# Altium project Cuk_30Gan_Grid_Project.PrjPcb
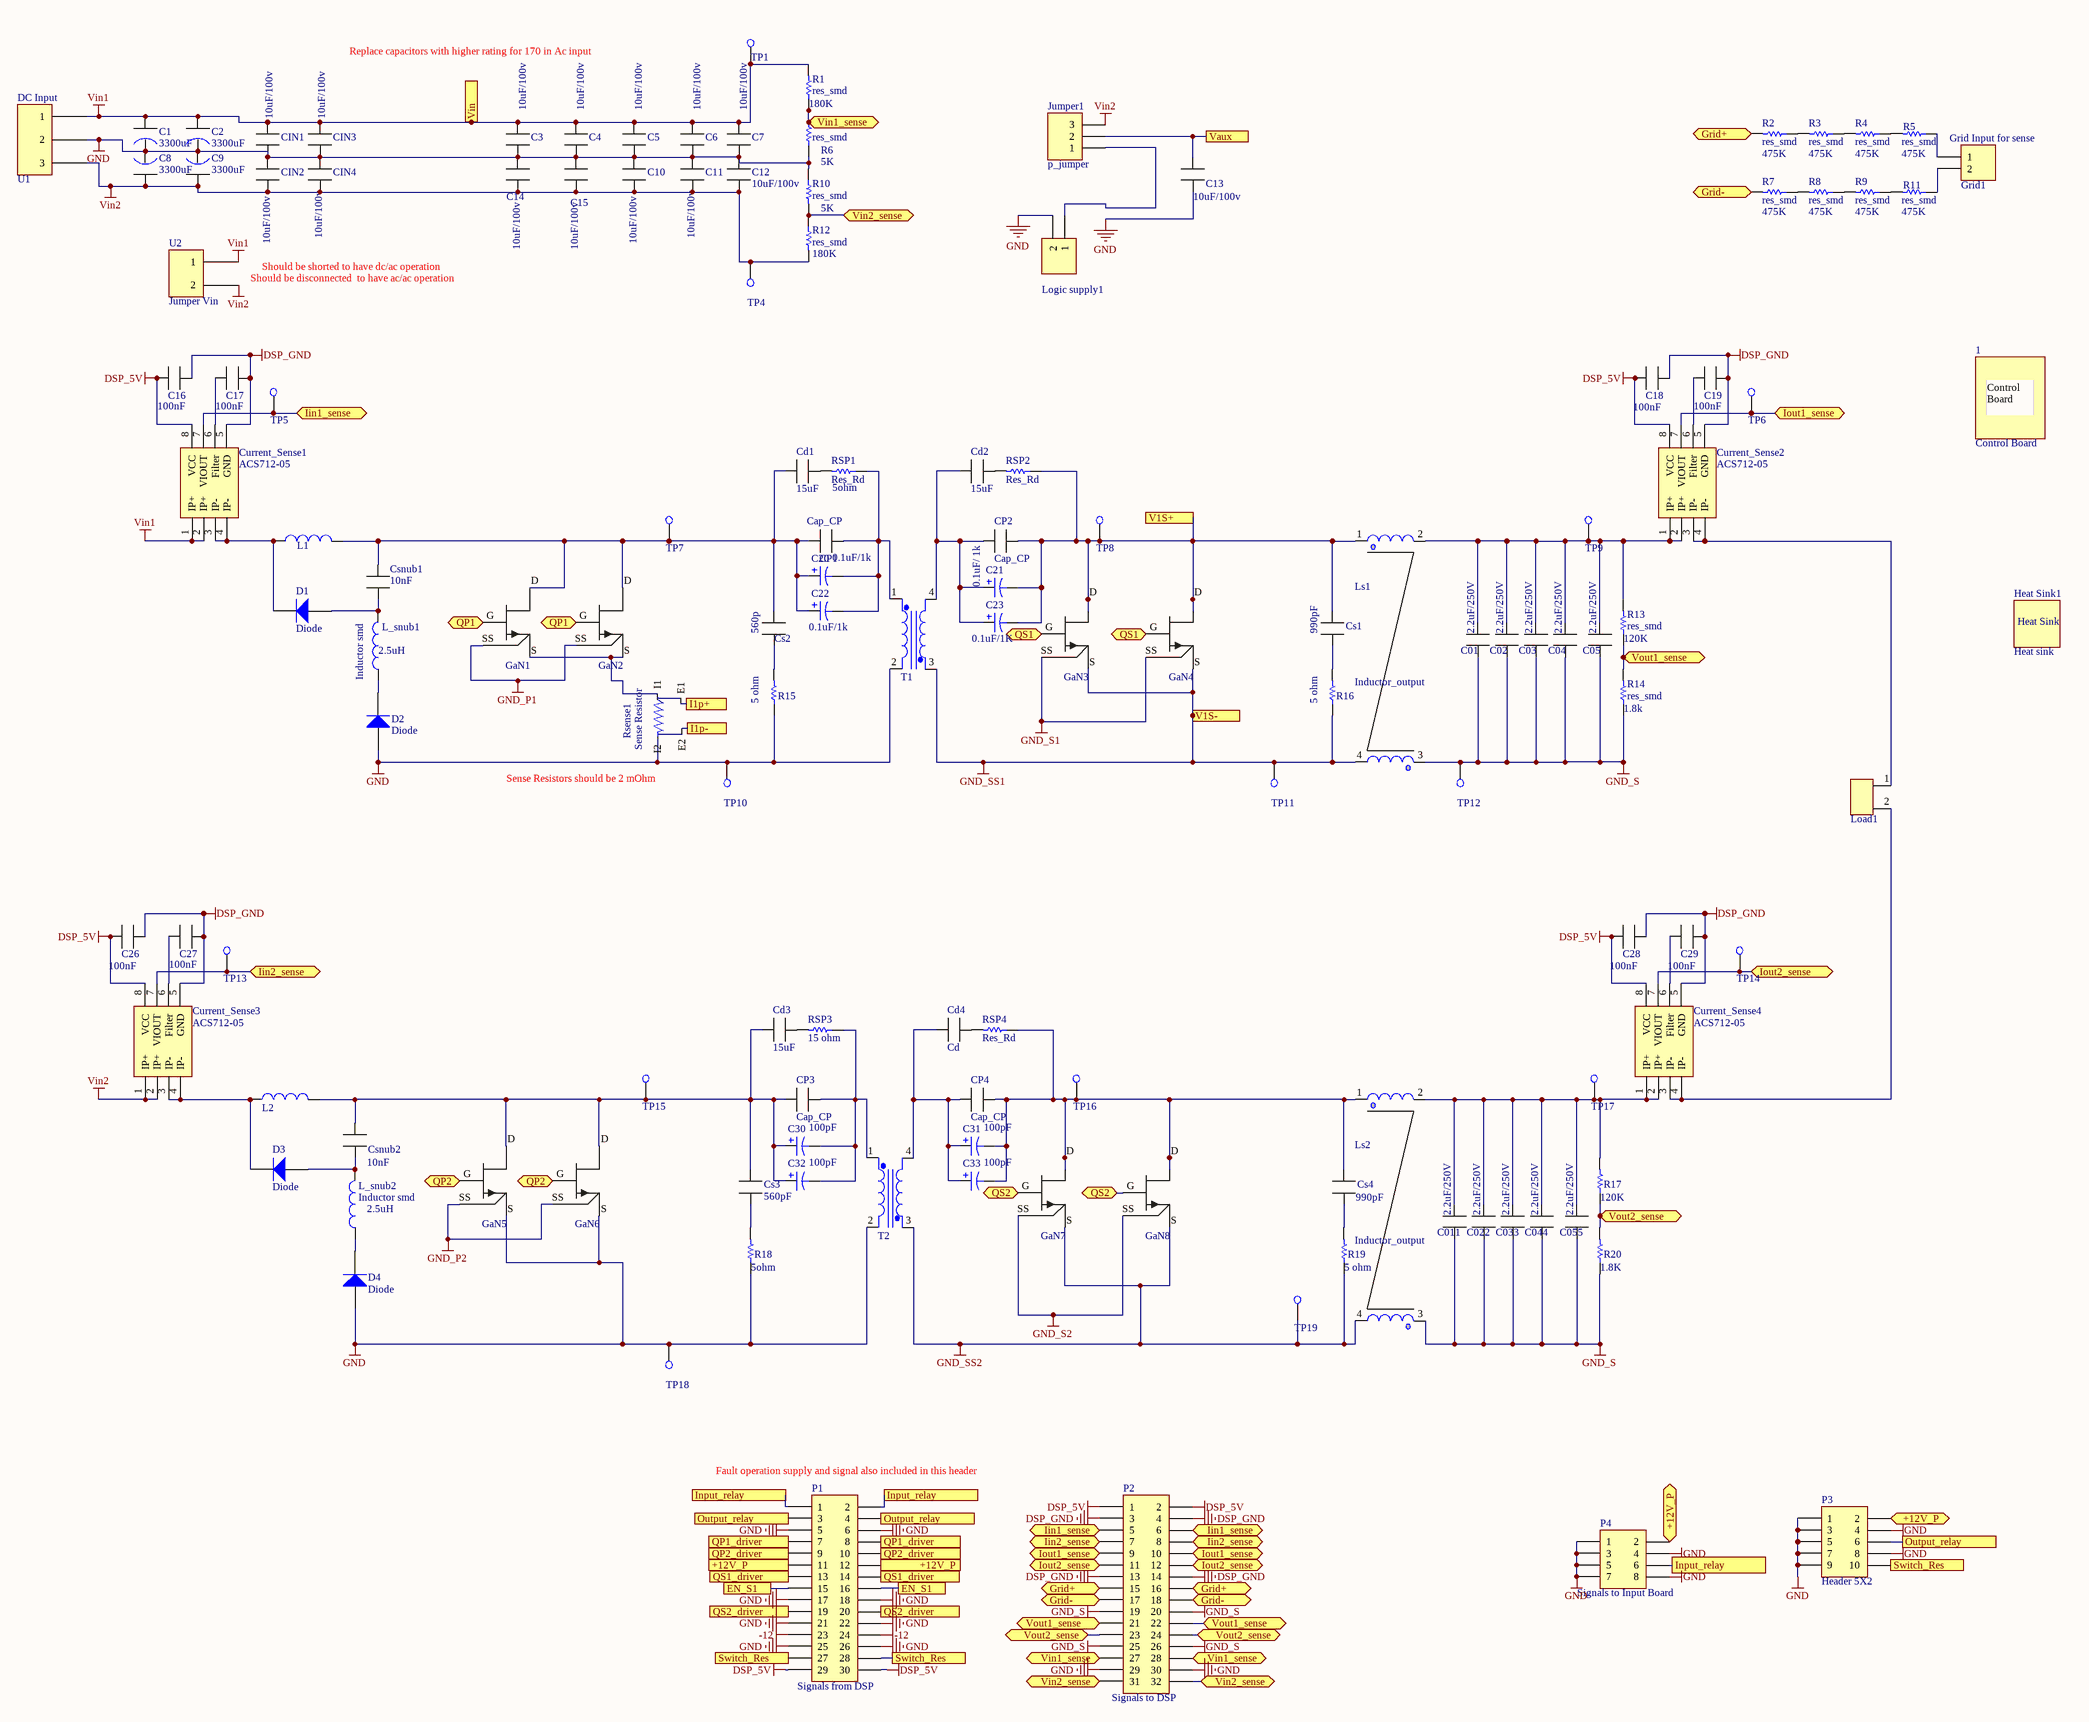
[diagram p0: Power_Board.SchDoc]
5 sheets, 394 parts. Net scope: flat (ports and power ports of the same name join across sheets).
Sheets:
  Power_Board.SchDoc
  Gate_Drivers.SchDoc
  Power_Supply.SchDoc
  Power_Supply2.SchDoc
  Protection_logic.SchDoc

## Sheet Power_Board.SchDoc: Power Stage Cuk 30 Amp GaN Board
size A2

### Parts
1  Control Board  [Control Board]
C1  3300uF  [Cap_3300uF_35mm height]
C01  Output_cap  [Output cap]  (value not drawn)
C02  Output_cap  [Output cap]  (value not drawn)
C2  3300uF  [Cap_3300uF_35mm height]
C3  Output_cap  [Output cap]  (value not drawn)
C03  Output_cap  [Output cap]  (value not drawn)
C4  Output_cap  [Output cap]  (value not drawn)
C04  Output_cap  [Output cap]  (value not drawn)
C5  Output_cap  [Output cap]  (value not drawn)
C05  Output_cap  [Output cap]  (value not drawn)
C6  Output_cap  [Output cap]  (value not drawn)
C7  Output_cap  [Output cap]  (value not drawn)
C8  3300uF  [Cap_3300uF_35mm height]
C9  3300uF  [Cap_3300uF_35mm height]
C10  Output_cap  [Output cap]  (value not drawn)
C11  Output_cap  [Output cap]  (value not drawn)
C011  Output_cap  [Output cap]  (value not drawn)
C12  Output_cap  [Output cap]  (value not drawn)
C13  Output_cap  [Output cap]  (value not drawn)
C14  Output_cap  [Output cap]  (value not drawn)
C15  Output_cap  [Output cap]  (value not drawn)
C16  100nF  [Cap_SMD]
C17  100nF  [Cap_SMD]
C18  100nF  [Cap_SMD]
C19  100nF  [Cap_SMD]
C20  value 0.1uF/1k  [1812]  (hidden comment: Cap Pol3)
C21  value 0.1uF/ 1k  [1812]  (hidden comment: Cap Pol3)
C22  value 0.1uF/1k  [1812]  (hidden comment: Cap Pol3)
C022  Output_cap  [Output cap]  (value not drawn)
C23  value 0.1uF/1K  [1812]  (hidden comment: Cap Pol3)
C26  100nF  [Cap_SMD]
C27  100nF  [Cap_SMD]
C28  100nF  [Cap_SMD]
C29  100nF  [Cap_SMD]
C30  value 100pF  [1812]  (hidden comment: Cap Pol3)
C31  value 100pF  [1812]  (hidden comment: Cap Pol3)
C32  value 100pF  [1812]  (hidden comment: Cap Pol3)
C33  value 100pF  [1812]  (hidden comment: Cap Pol3)
C033  Output_cap  [Output cap]  (value not drawn)
C044  Output_cap  [Output cap]  (value not drawn)
C055  Output_cap  [Output cap]  (value not drawn)
Cd1  15uF  [Cd]
Cd2  15uF  [Cd]
Cd3  15uF  [Cd]
Cd4  Cd  [Cd]
CIN1  Output_cap  [Output cap]  (value not drawn)
CIN2  Output_cap  [Output cap]  (value not drawn)
CIN3  Output_cap  [Output cap]  (value not drawn)
CIN4  Output_cap  [Output cap]  (value not drawn)
CP1  Cap_CP  [Cap_cp]
CP2  Cap_CP  [Cap_cp]
CP3  Cap_CP  [Cap_cp]
CP4  Cap_CP  [Cap_cp]
Cs1  990pF  [Cap-Cs]
Cs2  560p  [Cap-Cs]
Cs3  560pF  [Cap-Cs]
Cs4  Cap cdv16ff101j03  [Cap-Cs]  (value not drawn)
Csnub1  Cap DPPM10S22K-F  [Cap-Csnub]  (value not drawn)
Csnub2  Cap DPPM10S22K-F  [Cap-Csnub]  (value not drawn)
Current_Sense1  ACS712-05  [SOIC-8]
Current_Sense2  ACS712-05  [SOIC-8]
Current_Sense3  ACS712-05  [SOIC-8]
Current_Sense4  ACS712-05  [SOIC-8]
D1  Diode  [TO-277A]
D2  Diode  [TO-277A]
D3  Diode  [TO-277A]
D4  Diode  [TO-277A]
GaN1  GS66508B  [GS66508B]  (value not drawn)
GaN2  GS66508B  [GS66508B]  (value not drawn)
GaN3  GS66508B  [GS66508B]  (value not drawn)
GaN4  GS66508B  [GS66508B]  (value not drawn)
GaN5  GS66508B  [GS66508B]  (value not drawn)
GaN6  GS66508B  [GS66508B]  (value not drawn)
GaN7  GS66508B  [GS66508B]  (value not drawn)
GaN8  GS66508B  [GS66508B]  (value not drawn)
Grid1  Grid Input for sense  [Auxlilary connector]
Heat_Sink1  Heat sink  [Heat Sink]
Jumper1  p_jumper  [Header1*3]
L1  inductor  [Inductor_small]  (value not drawn)
L2  inductor  [Inductor_small_mirror]  (value not drawn)
L_snub1  Inductor smd  [Inductor surface mount]
L_snub2  Inductor smd  [Inductor surface mount]
Load1  Connector 60A  [Connector_60A]  (value not drawn)
Logic_supply1  Auxilary connector  [Auxlilary connector]  (value not drawn)
Ls1  Inductor_output  [Inductor output]
Ls2  Inductor_output  [Inductor output]
P1  Signals from DSP  [HDR2X15]
P2  Signals to DSP  [HDR2X16]
P3  Header 5X2  [HDR2X5]
P4  Signals to Input Board  [HDR2X4]
R1  res_smd  [res_smd]
R2  res_smd  [res_smd]
R3  res_smd  [res_smd]
R4  res_smd  [res_smd]
R5  res_smd  [res_smd]
R6  res_smd  [res_smd]
R7  res_smd  [res_smd]
R8  res_smd  [res_smd]
R9  res_smd  [res_smd]
R10  res_smd  [res_smd]
R11  res_smd  [res_smd]
R12  res_smd  [res_smd]
R13  res_smd  [res_smd]
R14  res_smd  [res_smd]
R15  res_snubber  [Res_Snub]  (value not drawn)
R16  res_snubber  [Res_Snub]  (value not drawn)
R17  res_smd  [res_smd]  (value not drawn)
R18  res_snubber  [Res_Snub]  (value not drawn)
R19  res_snubber  [Res_Snub]  (value not drawn)
R20  res_smd  [res_smd]  (value not drawn)
Rsense1  Sense Resistor  [Sense resistor]
RSP1  Res_Rd  [Res-RS]
RSP2  Res_Rd  [Res-RS]
RSP3  15 ohm  [Res-RS]
RSP4  Res_Rd  [Res-RS]
T1  Transformer  [Transformer]  (value not drawn)
T2  Transformer  [Big_transformer mirror]  (value not drawn)
TP1  Test Point  [Test Point]  (value not drawn)
TP4  Test Point  [Test Point]  (value not drawn)
TP5  Test Point  [Test Point]  (value not drawn)
TP6  Test Point  [Test Point]  (value not drawn)
TP7  Test Point  [Test Point]  (value not drawn)
TP8  Test Point  [Test Point]  (value not drawn)
TP9  Test Point  [Test Point]  (value not drawn)
TP10  Test Point  [Test Point]  (value not drawn)
TP11  Test Point  [Test Point]  (value not drawn)
TP12  Test Point  [Test Point]  (value not drawn)
TP13  Test Point  [Test Point]  (value not drawn)
TP14  Test Point  [Test Point]  (value not drawn)
TP15  Test Point  [Test Point]  (value not drawn)
TP16  Test Point  [Test Point]  (value not drawn)
TP17  Test Point  [Test Point]  (value not drawn)
TP18  Test Point  [Test Point]  (value not drawn)
TP19  Test Point  [Test Point]  (value not drawn)
U1  DC Input  [P-terminal 3]
U2  Jumper Vin  [P-Terminal 2]

### Ports
+12V_P, +12V_P (bidir), EN_S1, Grid+ (bidir), Grid- (bidir), I1p+, I1p-, Iin1_sense (bidir), Iin2_sense (bidir), Input_relay, Iout1_sense (bidir), Iout2_sense (bidir), Output_relay, QP1 (bidir), QP1_driver, QP2 (bidir), QP2_driver, QS1 (bidir), QS1_driver, QS2 (bidir), QS2_driver, Switch_Res, V1S+, V1S-, Vaux, Vin, Vin1_sense (bidir), Vin2_sense (bidir), Vout1_sense (bidir), Vout2_sense (bidir)

### Nets
-12: P1.23 P1.24
DSP_5V: C16.1 C18.1 C26.1 C28.1 Current_Sense1.8(VCC) Current_Sense2.8(VCC) Current_Sense3.8(VCC) Current_Sense4.8(VCC) P1.29 P1.30 P2.1 P2.2
DSP_GND: C16.2 C17.2 C18.2 C19.2 C26.2 C27.2 C28.2 C29.2 Current_Sense1.5(GND) Current_Sense2.5(GND) Current_Sense3.5(GND) Current_Sense4.5(GND) P2.3 P2.4 P2.13 P2.14
GND: C1.- C2.- C3.2 C4.2 C5.2 C6.2 C7.2 C8.- C9.- C10.2 C11.2 C12.2 C13.2 C14.2 C15.2 CIN1.2 CIN2.1 CIN3.2 CIN4.1 D2.1(A) D4.1(A) GaN5.S GaN6.S Logic_supply1.2 P1.5 P1.6 P1.17 P1.18 P1.21 P1.22 P1.25 P1.26 P2.29 P2.30 P3.1 P3.3 P3.4 P3.5 P3.7 P3.8 P3.9 P4.1 P4.3 P4.4 P4.5 P4.7 P4.8 R6.1 R10.1 R15.1 R18.1 Rsense1.2(I2) T1.2(P2) T2.2(P2) TP10.1(TP?) TP18.1(TP?) U1.2
GND_P1: GaN1.SS GaN2.SS
GND_P2: GaN5.SS GaN6.SS
GND_S: C01.2 C02.2 C03.2 C04.2 C05.2 C011.2 C022.2 C033.2 C044.2 C055.2 Ls1.3(-) Ls2.3(-) P2.19 P2.20 P2.25 P2.26 R14.1 R20.1 TP12.1(TP?)
GND_S1: GaN3.SS GaN4.SS
GND_S2: GaN7.SS GaN8.SS
GND_SS1: GaN3.S GaN4.S Ls1.4(+) R16.1 T1.3(S2) TP11.1(TP?) ; port V1S-
GND_SS2: GaN7.S GaN8.S Ls2.4(+) R19.1 T2.3(S2) TP19.1(TP?)
Vin1: C1.+ C2.+ C3.1 C4.1 C5.1 C6.1 C7.1 CIN1.1 CIN3.1 Current_Sense1.1(IP+) Current_Sense1.2(IP+) R1.2 TP1.1(TP?) U1.1 U2.1 ; port Vin
Vin2: C8.+ C9.+ C10.1 C11.1 C12.1 C14.1 C15.1 CIN2.2 CIN4.2 Current_Sense3.1(IP+) Current_Sense3.2(IP+) Jumper1.3 R12.2 TP4.1(TP?) U1.3 U2.2
NetC01_1: C01.1 C02.1 C03.1 C04.1 C05.1 Current_Sense2.1(IP+) Current_Sense2.2(IP+) Ls1.2(-) R13.2 TP9.1(TP?)
NetC011_1: C011.1 C022.1 C033.1 C044.1 C055.1 Current_Sense4.1(IP+) Current_Sense4.2(IP+) Ls2.2(-) R17.2 TP17.1(TP?)
NetC13_1: C13.1 Jumper1.2 ; port Vaux
NetC17_1: C17.1 Current_Sense1.6(Filter)
NetC19_1: C19.1 Current_Sense2.6(Filter)
NetC20_1: C20.1 C22.1 Cd1.1 CP1.1 Cs2.1 Csnub1.1 GaN1.D GaN2.D L1.2(-) TP7.1(TP?)
NetC20_2: C20.2 C22.2 CP1.2 RSP1.1 T1.1(P1)
NetC21_1: C21.1 C23.1 Cd2.1 CP2.1 T1.4(S1)
NetC21_2: C21.2 C23.2 CP2.2 Cs1.1 GaN3.D GaN4.D Ls1.1(+) RSP2.1 TP8.1(TP?) ; port V1S+
NetC27_1: C27.1 Current_Sense3.6(Filter)
NetC29_1: C29.1 Current_Sense4.6(Filter)
NetC30_1: C30.1 C32.1 Cd3.1 CP3.1 Cs3.1 Csnub2.1 GaN5.D GaN6.D L2.2(-) TP15.1(TP?)
NetC30_2: C30.2 C32.2 CP3.2 RSP3.1 T2.1(P1)
NetC31_1: C31.1 C33.1 Cd4.1 CP4.1 T2.4(S1)
NetC31_2: C31.2 C33.2 CP4.2 Cs4.1 GaN7.D GaN8.D Ls2.1(+) RSP4.1 TP16.1(TP?)
NetC56_1: P1.11 P1.12 P3.2 P4.2 ; port +12V_P
NetCd1_2: Cd1.2 RSP1.2
NetCd2_2: Cd2.2 RSP2.2
NetCd3_2: Cd3.2 RSP3.2
NetCd4_2: Cd4.2 RSP4.2
NetCs1_2: Cs1.2 R16.2
NetCs2_2: Cs2.2 R15.2
NetCs3_2: Cs3.2 R18.2
NetCs4_2: Cs4.2 R19.2
NetCsnub1_2: Csnub1.2 D1.1(A) L_snub1.2(-)
NetCsnub2_2: Csnub2.2 D3.1(A) L_snub2.2(-)
NetCurrent_Sense1_3: Current_Sense1.3(IP-) Current_Sense1.4(IP-) D1.2(K) L1.1(+)
NetCurrent_Sense1_7: Current_Sense1.7(VIOUT) P2.5 P2.6 TP5.1(TP?) ; port Iin1_sense
NetCurrent_Sense2_3: Current_Sense2.3(IP-) Current_Sense2.4(IP-) Load1.1
NetCurrent_Sense2_7: Current_Sense2.7(VIOUT) P2.9 P2.10 TP6.1(TP?) ; port Iout1_sense
NetCurrent_Sense3_3: Current_Sense3.3(IP-) Current_Sense3.4(IP-) D3.2(K) L2.1(+)
NetCurrent_Sense3_7: Current_Sense3.7(VIOUT) P2.7 P2.8 TP13.1(TP?) ; port Iin2_sense
NetCurrent_Sense4_3: Current_Sense4.3(IP-) Current_Sense4.4(IP-) Load1.2
NetCurrent_Sense4_7: Current_Sense4.7(VIOUT) P2.11 P2.12 TP14.1(TP?) ; port Iout2_sense
NetD2_2: D2.2(K) L_snub1.1(+)
NetD4_2: D4.2(K) L_snub2.1(+)
NetFB1_2: GaN1.G GaN2.G ; port QP1
NetFB3_2: GaN3.G GaN4.G ; port QS1
NetFB5_2: GaN5.G GaN6.G ; port QP2
NetFB7_2: GaN7.G GaN8.G ; port QS2
NetGaN1_S: GaN1.S GaN2.S Rsense1.1(I1)
NetGrid1_1: Grid1.1 R5.1
NetGrid1_2: Grid1.2 R11.1
NetJumper1_1: Jumper1.1 Logic_supply1.1
NetJumper2_3: P1.15 P1.16 ; port EN_S1
NetP1_1: P1.1 P1.2 P4.6 ; port Input_relay
NetP1_3: P1.3 P1.4 P3.6 ; port Output_relay
NetP1_7: P1.7 P1.8 ; port QP1_driver
NetP1_9: P1.9 P1.10 ; port QP2_driver
NetP1_13: P1.13 P1.14 ; port QS1_driver
NetP1_19: P1.19 P1.20 ; port QS2_driver
NetP1_27: P1.27 P1.28 P3.10 ; port Switch_Res
NetP2_15: P2.15 P2.16 R2.2 ; port Grid+
NetP2_17: P2.17 P2.18 R7.2 ; port Grid-
NetP2_21: P2.21 P2.22 R13.1 R14.2 ; port Vout1_sense
NetP2_23: P2.23 P2.24 R17.1 R20.2 ; port Vout2_sense
NetP2_27: P2.27 P2.28 R1.1 R6.2 ; port Vin1_sense
NetP2_31: P2.31 P2.32 R10.2 R12.1 ; port Vin2_sense
NetR2_1: R2.1 R3.2
NetR3_1: R3.1 R4.2
NetR4_1: R4.1 R5.2
NetR7_1: R7.1 R8.2
NetR8_1: R8.1 R9.2
NetR9_1: R9.1 R11.2
NetR76_2: Rsense1.3(E1) ; port I1p+
NetR80_2: Rsense1.4(E2) ; port I1p-

### Notes on the sheet
- Replace capacitors with higher rating for 170 in Ac input
- Should be disconnected  to have ac/ac operation
- Should be shorted to have dc/ac operation
- Sense Resistors should be 2 mOhm
- (near P1) Fault operation supply and signal also included in this header
- (in symbol Cap-CS) 990pF
- (in symbol Cap-Csnub) 10nF
- (in symbol Heat sink) Heat Sink
- (in symbol Inductor smd) 2.5uH
- (in symbol Output_cap) 10uF/100v; 2.2uF/250V
- (in symbol Res_Rd) 5ohm
- (in symbol res_smd) 120K; 1.8k; 180K; 5K; 1.8K; 475K
- (in symbol res_snubber) 5 ohm; 5ohm

### Library data of the parts
C1 C2 C8 C9 = 3300uF: LLS2A332MELC
C16-C19 C26-C29 = Cap_SMD
C20-C23 C30-C33 = Cap Pol3: Polarized Capacitor (Surface Mount); Published: 8-Jun-2000; LatestRevisionDate: 29-May-2009; LatestRevisionNote: IPC-7351 Footprint Added.; PackageReference: C0805; Publisher: Altium Limited; PackageDescription: Chip Capacitor
Cd1-Cd3 = Cd
Cs1-Cs4 = Cap-CS
Csnub1 Csnub2 = Cap-Csnub
Current_Sense1-Current_Sense4 = Current Sensor 5A
D1-D4 = Diode: VS-4ESH02HM3
Grid1 = Auxilary connector
P1 = Header 15X2: Header, 15-Pin, Dual row; LatestRevisionDate: 17-Jul-2002; LatestRevisionNote: Re-released for DXP Platform.; Publisher: Altium Limited
P2 = Header 16X2: Header, 16-Pin, Dual row; LatestRevisionDate: 17-Jul-2002; LatestRevisionNote: Re-released for DXP Platform.; Publisher: Altium Limited
P3 = Header 5X2: Header, 5-Pin, Dual row; LatestRevisionDate: 17-Jul-2002; LatestRevisionNote: Re-released for DXP Platform.; Publisher: Altium Limited
P4 = Header 4X2: Header, 4-Pin, Dual row; LatestRevisionDate: 17-Jul-2002; LatestRevisionNote: Re-released for DXP Platform.; Publisher: Altium Limited
R1-R14 R17 R20 = res_smd: smd_res
R15 R16 R18 R19 = res_snubber: snubber_res_film
RSP3 = Res_Rd
U1 = P-Terminal 3
U2 = P-Terminal 2

## Sheet Gate_Drivers.SchDoc
size Legal
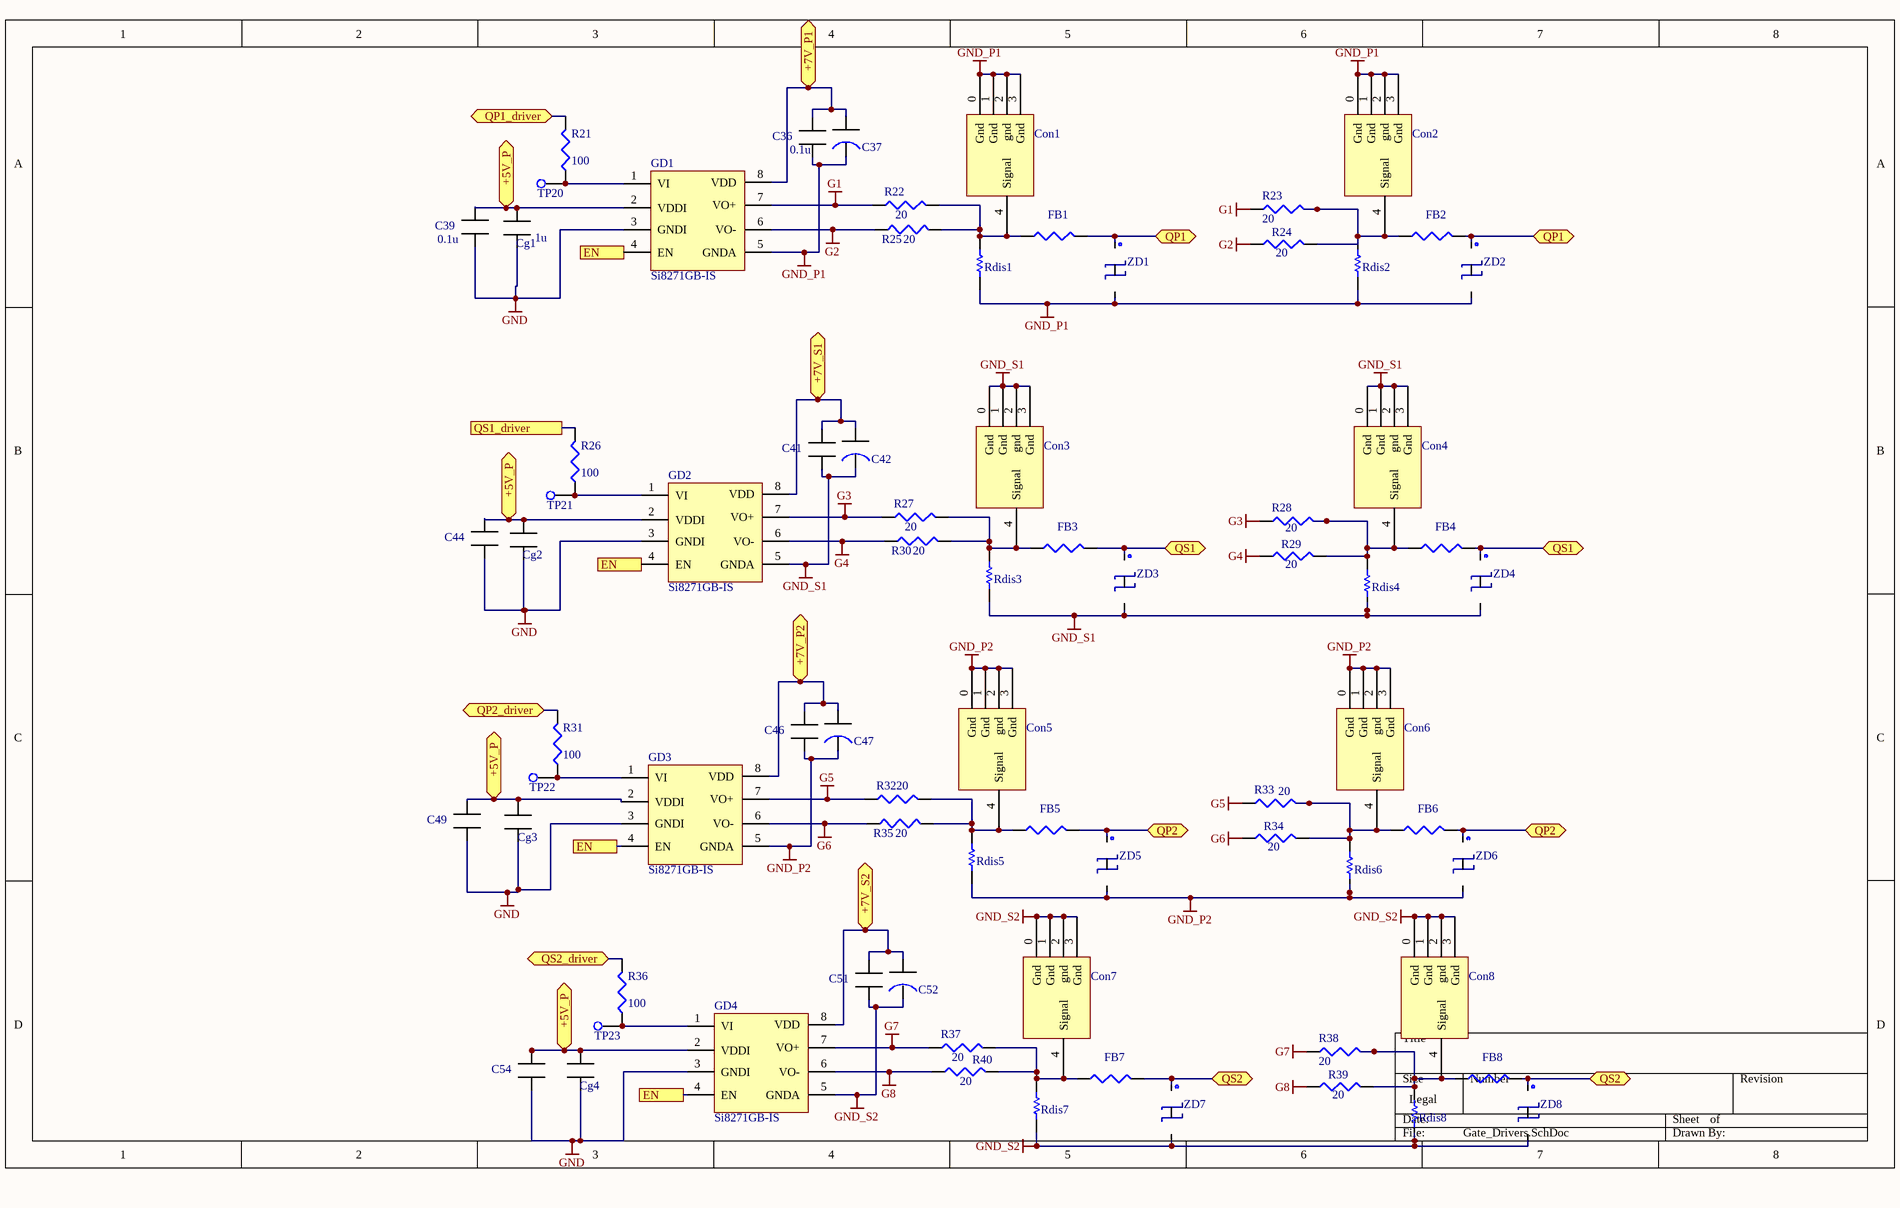
[diagram p1: Gate_Drivers.SchDoc]

### Parts
C36  100nF  [Cap_SMD]  (value not drawn)
C37  22uF  [Cap_tantalum]  (value not drawn)
C39  100nF  [Cap_SMD]  (value not drawn)
C41  100nF  [Cap_SMD]  (value not drawn)
C42  22uF  [Cap_tantalum]  (value not drawn)
C44  100nF  [Cap_SMD]  (value not drawn)
C46  100nF  [Cap_SMD]  (value not drawn)
C47  22uF  [Cap_tantalum]  (value not drawn)
C49  100nF  [Cap_SMD]  (value not drawn)
C51  100nF  [Cap_SMD]  (value not drawn)
C52  22uF  [Cap_tantalum]  (value not drawn)
C54  100nF  [Cap_SMD]  (value not drawn)
Cg1  100nF  [Cap_SMD]  (value not drawn)
Cg2  100nF  [Cap_SMD]  (value not drawn)
Cg3  100nF  [Cap_SMD]  (value not drawn)
Cg4  100nF  [Cap_SMD]  (value not drawn)
Con1  Component_1  [PCBComponent_1]  (value not drawn)
Con2  Component_1  [PCBComponent_1]  (value not drawn)
Con3  Component_1  [PCBComponent_1]  (value not drawn)
Con4  Component_1  [PCBComponent_1]  (value not drawn)
Con5  Component_1  [PCBComponent_1]  (value not drawn)
Con6  Component_1  [PCBComponent_1]  (value not drawn)
Con7  Component_1  [PCBComponent_1]  (value not drawn)
Con8  Component_1  [PCBComponent_1]  (value not drawn)
FB1  Res3  [J1-0603]  (value not drawn)
FB2  Res3  [J1-0603]  (value not drawn)
FB3  Res3  [J1-0603]  (value not drawn)
FB4  Res3  [J1-0603]  (value not drawn)
FB5  Res3  [J1-0603]  (value not drawn)
FB6  Res3  [J1-0603]  (value not drawn)
FB7  Res3  [J1-0603]  (value not drawn)
FB8  Res3  [J1-0603]  (value not drawn)
GD1  Si8271GB-IS  [Si8271]
GD2  Si8271GB-IS  [Si8271]
GD3  Si8271GB-IS  [Si8271]
GD4  Si8271GB-IS  [Si8271]
R21  value 100  [J1-0603]  (hidden comment: Res3)
R22  value 20  [J1-0603]  (hidden comment: Res3)
R23  value 20  [J1-0603]  (hidden comment: Res3)
R24  20  [J1-0603]
R25  value 20  [J1-0603]  (hidden comment: Res3)
R26  value 100  [J1-0603]  (hidden comment: Res3)
R27  value 20  [J1-0603]  (hidden comment: Res3)
R28  value 20  [J1-0603]  (hidden comment: Res3)
R29  20  [J1-0603]
R30  value 20  [J1-0603]  (hidden comment: Res3)
R31  value 100  [J1-0603]  (hidden comment: Res3)
R32  value 20  [J1-0603]  (hidden comment: Res3)
R33  value 20  [J1-0603]  (hidden comment: Res3)
R34  20  [J1-0603]
R35  value 20  [J1-0603]  (hidden comment: Res3)
R36  value 100  [J1-0603]  (hidden comment: Res3)
R37  value 20  [J1-0603]  (hidden comment: Res3)
R38  value 20  [J1-0603]  (hidden comment: Res3)
R39  20  [J1-0603]
R40  value 20  [J1-0603]  (hidden comment: Res3)
Rdis1  res_smd  [J1-0603]  (value not drawn)
Rdis2  res_smd  [J1-0603]  (value not drawn)
Rdis3  res_smd  [J1-0603]  (value not drawn)
Rdis4  res_smd  [J1-0603]  (value not drawn)
Rdis5  res_smd  [J1-0603]  (value not drawn)
Rdis6  res_smd  [J1-0603]  (value not drawn)
Rdis7  res_smd  [J1-0603]  (value not drawn)
Rdis8  res_smd  [J1-0603]  (value not drawn)
TP20  Test Point  [Test Point]  (value not drawn)
TP21  Test Point  [Test Point]  (value not drawn)
TP22  Test Point  [Test Point]  (value not drawn)
TP23  Test Point  [Test Point]  (value not drawn)
ZD1  8.2 v  [Zener Diode]  (value not drawn)
ZD2  8.2 v  [Zener Diode]  (value not drawn)
ZD3  8.2 v  [Zener Diode]  (value not drawn)
ZD4  8.2 v  [Zener Diode]  (value not drawn)
ZD5  8.2 v  [Zener Diode]  (value not drawn)
ZD6  8.2 v  [Zener Diode]  (value not drawn)
ZD7  8.2 v  [Zener Diode]  (value not drawn)
ZD8  8.2 v  [Zener Diode]  (value not drawn)

### Ports
+5V_P (bidir), +7V_P1 (bidir), +7V_P2 (bidir), +7V_S1 (bidir), +7V_S2 (bidir), EN, QP1 (bidir), QP1_driver (bidir), QP2 (bidir), QP2_driver (bidir), QS1 (bidir), QS1_driver, QS2 (bidir), QS2_driver (bidir)

### Nets
+5V_P: C39.1 C44.1 C49.1 C54.1 Cg1.1 Cg2.1 Cg3.1 Cg4.1 GD1.2(VDDI) GD2.2(VDDI) GD3.2(VDDI) GD4.2(VDDI) ; port +5V_P
G1: GD1.7(VO+) R22.1 R23.1
G2: GD1.6(VO-) R24.1 R25.1
G3: GD2.7(VO+) R27.1 R28.1
G4: GD2.6(VO-) R29.1 R30.1
G5: GD3.7(VO+) R32.1 R33.1
G6: GD3.6(VO-) R34.1 R35.1
G7: GD4.7(VO+) R37.1 R38.1
G8: GD4.6(VO-) R39.1 R40.1
GND: C39.2 C44.2 C49.2 C54.2 Cg1.2 Cg2.2 Cg3.2 Cg4.2 GD1.3(GNDI) GD2.3(GNDI) GD3.3(GNDI) GD4.3(GNDI)
GND_P1: C36.2 C37.2 Con1.0(Gnd) Con1.1(Gnd) Con1.2(gnd) Con1.3(Gnd) Con2.0(Gnd) Con2.1(Gnd) Con2.2(gnd) Con2.3(Gnd) GD1.5(GNDA) Rdis1.2 Rdis2.2 ZD1.2 ZD2.2
GND_P2: C46.2 C47.2 Con5.0(Gnd) Con5.1(Gnd) Con5.2(gnd) Con5.3(Gnd) Con6.0(Gnd) Con6.1(Gnd) Con6.2(gnd) Con6.3(Gnd) GD3.5(GNDA) Rdis5.2 Rdis6.2 ZD5.2 ZD6.2
GND_S1: C41.2 C42.2 Con3.0(Gnd) Con3.1(Gnd) Con3.2(gnd) Con3.3(Gnd) Con4.0(Gnd) Con4.1(Gnd) Con4.2(gnd) Con4.3(Gnd) GD2.5(GNDA) Rdis3.2 Rdis4.2 ZD3.2 ZD4.2
GND_S2: C51.2 C52.2 Con7.0(Gnd) Con7.1(Gnd) Con7.2(gnd) Con7.3(Gnd) Con8.0(Gnd) Con8.1(Gnd) Con8.2(gnd) Con8.3(Gnd) GD4.5(GNDA) Rdis7.2 Rdis8.2 ZD7.2 ZD8.2
NetC36_1: C36.1 C37.1 GD1.8(VDD) ; port +7V_P1
NetC41_1: C41.1 C42.1 GD2.8(VDD) ; port +7V_S1
NetC46_1: C46.1 C47.1 GD3.8(VDD) ; port +7V_P2
NetC51_1: C51.1 C52.1 GD4.8(VDD) ; port +7V_S2
NetCon1_4: Con1.4(Signal) FB1.1 R22.2 R25.2 Rdis1.1
NetCon2_4: Con2.4(Signal) FB2.1 R23.2 R24.2 Rdis2.1
NetCon3_4: Con3.4(Signal) FB3.1 R27.2 R30.2 Rdis3.1
NetCon4_4: Con4.4(Signal) FB4.1 R28.2 R29.2 Rdis4.1
NetCon5_4: Con5.4(Signal) FB5.1 R32.2 R35.2 Rdis5.1
NetCon6_4: Con6.4(Signal) FB6.1 R33.2 R34.2 Rdis6.1
NetCon7_4: Con7.4(Signal) FB7.1 R37.2 R40.2 Rdis7.1
NetCon8_4: Con8.4(Signal) FB8.1 R38.2 R39.2 Rdis8.1
NetFB1_2: FB1.2 FB2.2 ZD1.1 ZD2.1 ; port QP1
NetFB3_2: FB3.2 FB4.2 ZD3.1 ZD4.1 ; port QS1
NetFB5_2: FB5.2 FB6.2 ZD5.1 ZD6.1 ; port QP2
NetFB7_2: FB7.2 FB8.2 ZD7.1 ZD8.1 ; port QS2
NetGD1_1: GD1.1(VI) R21.1 TP20.1(TP?)
NetGD1_4: GD1.4(EN) GD2.4(EN) GD3.4(EN) GD4.4(EN) ; port EN
NetGD2_1: GD2.1(VI) R26.1 TP21.1(TP?)
NetGD3_1: GD3.1(VI) R31.1 TP22.1(TP?)
NetGD4_1: GD4.1(VI) R36.1 TP23.1(TP?)
NetP1_7: R21.2 ; port QP1_driver
NetP1_9: R31.2 ; port QP2_driver
NetP1_13: R26.2 ; port QS1_driver
NetP1_19: R36.2 ; port QS2_driver

Not connected (* = marked no-connect by the designer): ZD1 3; ZD2 3; ZD3 3; ZD4 3; ZD5 3; ZD6 3; ZD7 3; ZD8 3

### Notes on the sheet
- (in symbol Cap_SMD) 0.1u; 1u

### Library data of the parts
C36 C39 C41 C44 C46 C49 C51 C54 Cg1-Cg4 = Cap_SMD
C37 C42 C47 C52 = Cap_tantalum
FB1-FB8 R24 R29 R34 R39 = Res3: Resistor; Value: 1K; Published: 8-Jun-2000; LatestRevisionDate: 29-May-2009; LatestRevisionNote: IPC-7351 Footprint Added.; PackageReference: J1-0603; Publisher: Altium Limited; PackageDescription: Chip Resistor
R21-R23 R25-R28 R30-R33 R35-R38 R40 = Res3: Resistor; Published: 8-Jun-2000; LatestRevisionDate: 29-May-2009; LatestRevisionNote: IPC-7351 Footprint Added.; PackageReference: J1-0603; Publisher: Altium Limited; PackageDescription: Chip Resistor
Rdis1-Rdis8 = res_smd: smd_res
ZD1-ZD8 = Zener_diode: DZ23C8V2-7-F

## Sheet Power_Supply.SchDoc
size A
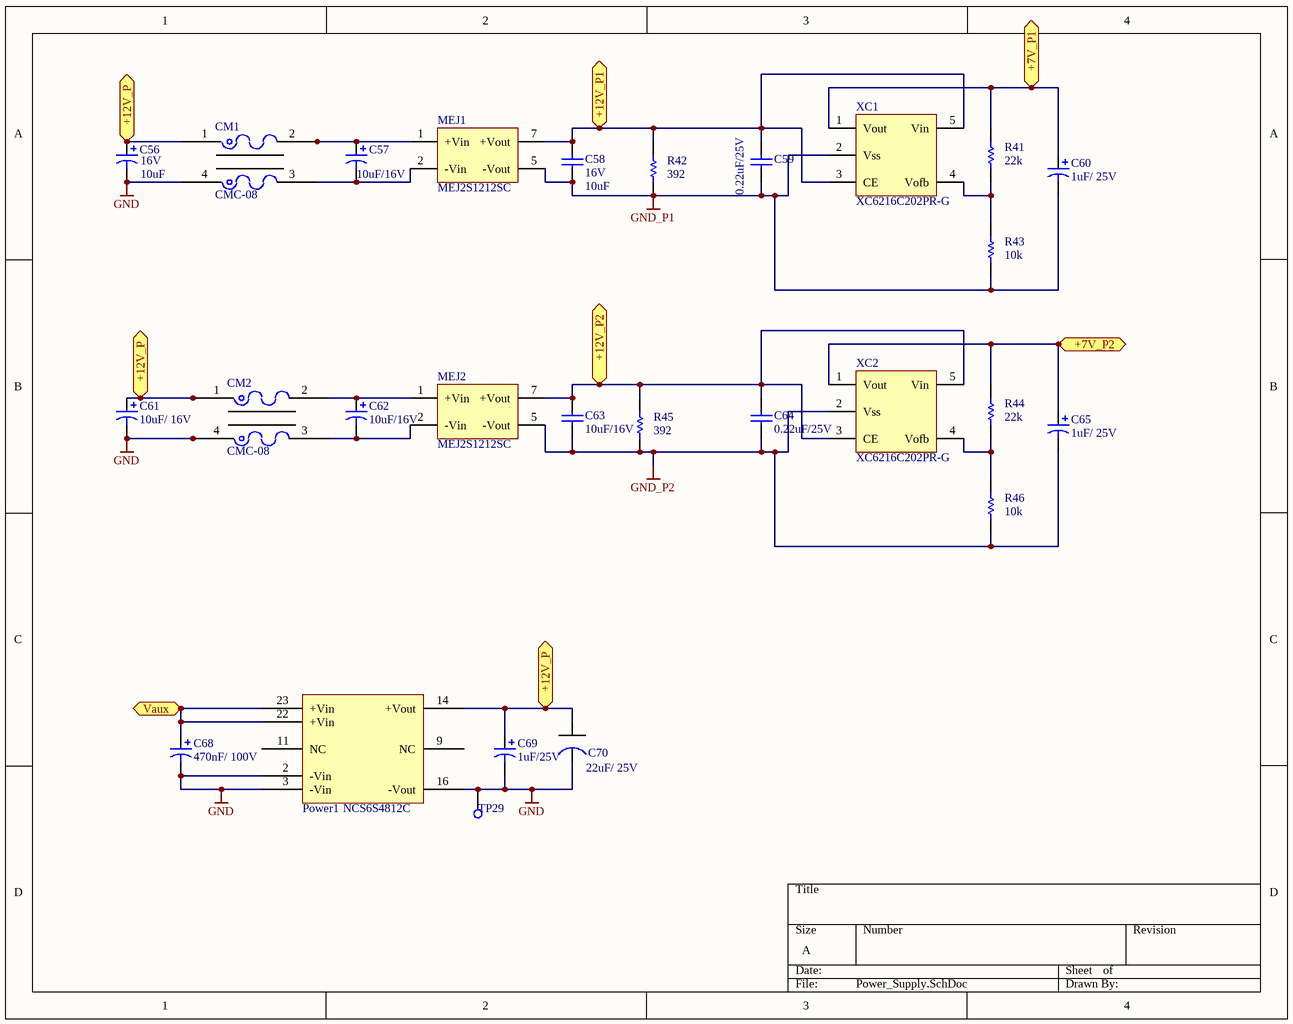
[diagram p2: Power_Supply.SchDoc]

### Parts
C56  16V  value 10uF  [1812]
C57  value 10uF/16V  [1812]  (hidden comment: Cap Pol3)
C58  16V  value 10uF  [C1206]
C59  value 0.22uF/25V  [C1206]  (hidden comment: Cap Semi)
C60  value 1uF/ 25V  [C0805]  (hidden comment: Cap Pol3)
C61  value 10uF/ 16V  [1812]  (hidden comment: Cap Pol3)
C62  value 10uF/16V  [1812]  (hidden comment: Cap Pol3)
C63  value 10uF/16V  [C1206]  (hidden comment: Cap Semi)
C64  value 0.22uF/25V  [C1206]  (hidden comment: Cap Semi)
C65  value 1uF/ 25V  [C0805]  (hidden comment: Cap Pol3)
C68  value 470nF/ 100V  [C0805]  (hidden comment: Cap Pol3)
C69  value 1uF/25V  [C0805]  (hidden comment: Cap Pol3)
C70  22uF  [Cap_tantalum]  (value not drawn)
CM1  CMC-08  [CMC-08]
CM2  CMC-08  [CMC-08]
MEJ1  MEJ2S1212SC  [MEJ2]
MEJ2  MEJ2S1212SC  [MEJ2]
Power1  NCS6S4812C  [Power_main]
R41  res_smd  [res_smd]  (value not drawn)
R42  res_smd  [res_smd]  (value not drawn)
R43  res_smd  [res_smd]  (value not drawn)
R44  res_smd  [res_smd]  (value not drawn)
R45  res_smd  [res_smd]  (value not drawn)
R46  res_smd  [res_smd]  (value not drawn)
TP29  Test Point  [Test Point]  (value not drawn)
XC1  XC6216C202PR-G  [SOT-89-5]
XC2  XC6216C202PR-G  [SOT-89-5]

### Ports
+7V_P1 (bidir), +7V_P2 (bidir), +12V_P1 (bidir), +12V_P2 (bidir), +12V_P (bidir), Vaux

### Nets
GND: C56.2 C61.2 C68.2 C69.2 C70.2 CM1.4 CM2.4 Power1.2(-Vin) Power1.3(-Vin) Power1.16(-Vout) TP29.1(TP?)
GND_P1: C58.1 C59.1 C60.2 MEJ1.5(-Vout) R42.2 R43.2 XC1.2(Vss)
GND_P2: C63.1 C64.1 C65.2 MEJ2.5(-Vout) R45.2 R46.2 XC2.2(Vss)
NetC13_1: C68.1 Power1.22(+Vin) Power1.23(+Vin) ; port Vaux
NetC36_1: C60.1 R41.1 XC1.1(Vout) ; port +7V_P1
NetC46_1: C65.1 R44.1 XC2.1(Vout) ; port +7V_P2
NetC56_1: C56.1 C61.1 C69.1 C70.1 CM1.1 CM2.1 Power1.14(+Vout) ; port +12V_P
NetC57_1: C57.1 CM1.2 MEJ1.1(+Vin)
NetC57_2: C57.2 CM1.3 MEJ1.2(-Vin)
NetC58_2: C58.2 C59.2 MEJ1.7(+Vout) R42.1 XC1.3(CE) XC1.5(Vin) ; port +12V_P1
NetC62_1: C62.1 CM2.2 MEJ2.1(+Vin)
NetC62_2: C62.2 CM2.3 MEJ2.2(-Vin)
NetC63_2: C63.2 C64.2 MEJ2.7(+Vout) R45.1 XC2.3(CE) XC2.5(Vin) ; port +12V_P2
NetR41_2: R41.2 R43.1 XC1.4(Vofb)
NetR44_2: R44.2 R46.1 XC2.4(Vofb)

Not connected (* = marked no-connect by the designer): Power1 9(NC) 11(NC)

### Notes on the sheet
- (in symbol Cap_tantalum) 22uF/ 25V
- (in symbol res_smd) 392; 22k; 10k

### Library data of the parts
C56 C57 C60-C62 C65 C68 C69 = Cap Pol3: Polarized Capacitor (Surface Mount); Published: 8-Jun-2000; LatestRevisionDate: 29-May-2009; LatestRevisionNote: IPC-7351 Footprint Added.; PackageReference: C0805; Publisher: Altium Limited; PackageDescription: Chip Capacitor
C58 C59 C63 C64 = Cap Semi: Capacitor (Semiconductor SIM Model); Published: 8-Jun-2000; LatestRevisionDate: 29-May-2009; LatestRevisionNote: IPC-7351 Footprint Added.; PackageReference: C1206; Publisher: Altium Limited; PackageDescription: Chip Capacitor
C70 = Cap_tantalum
CM1 CM2 = CMC-08: Common mode choke
MEJ1 MEJ2 = Power supply2
Power1 = Power_main
R41-R46 = res_smd: smd_res
XC1 XC2 = power supply

## Sheet Power_Supply2.SchDoc
size A
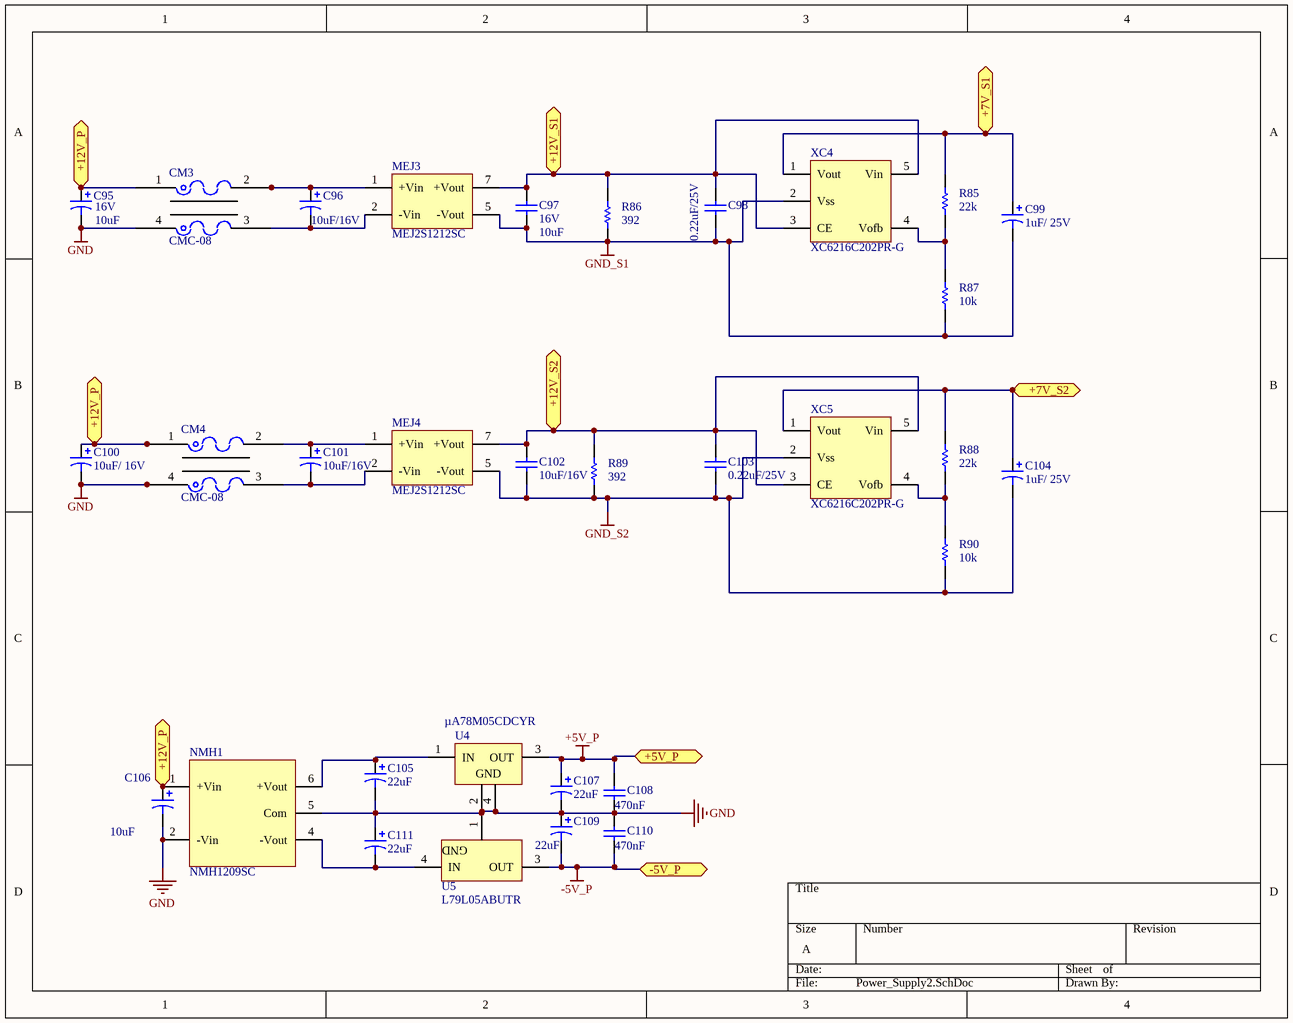
[diagram p3: Power_Supply2.SchDoc]

### Parts
C95  16V  value 10uF  [1812]
C96  value 10uF/16V  [1812]  (hidden comment: Cap Pol3)
C97  16V  value 10uF  [C1206]
C98  value 0.22uF/25V  [C1206]  (hidden comment: Cap Semi)
C99  value 1uF/ 25V  [C0805]  (hidden comment: Cap Pol3)
C100  value 10uF/ 16V  [1812]  (hidden comment: Cap Pol3)
C101  value 10uF/16V  [1812]  (hidden comment: Cap Pol3)
C102  value 10uF/16V  [C1206]  (hidden comment: Cap Semi)
C103  value 0.22uF/25V  [C1206]  (hidden comment: Cap Semi)
C104  value 1uF/ 25V  [C0805]  (hidden comment: Cap Pol3)
C105  value 22uF  [Cap tantal 22u-25V]  (hidden comment: Tantalium)
C106  value 10uF  [CAP-10u-16V]  (hidden comment: electrolytic)
C107  value 22uF  [Cap Tantal 3216]  (hidden comment: Tantalium/T520A226M006ATE090)
C108  value 470nF  [Capacitor 0805]  (hidden comment: Cap)
C109  value 22uF  [Cap Tantal 3216]  (hidden comment: Tantalium/T520A226M006ATE090)
C110  value 470nF  [Capacitor 0805]  (hidden comment: Cap)
C111  value 22uF  [Cap tantal 22u-25V]  (hidden comment: Tantalium)
CM3  CMC-08  [CMC-08]
CM4  CMC-08  [CMC-08]
MEJ3  MEJ2S1212SC  [MEJ2]
MEJ4  MEJ2S1212SC  [MEJ2]
NMH1  NMH1209SC  [NMH1209SC]
R85  res_smd  [res_smd]  (value not drawn)
R86  res_smd  [res_smd]  (value not drawn)
R87  res_smd  [res_smd]  (value not drawn)
R88  res_smd  [res_smd]  (value not drawn)
R89  res_smd  [res_smd]  (value not drawn)
R90  res_smd  [res_smd]  (value not drawn)
U4  µA78M05CDCYR  [Reg - SOT223]
U5  L79L05ABUTR  [Reg SOT-89]
XC4  XC6216C202PR-G  [SOT-89-5]
XC5  XC6216C202PR-G  [SOT-89-5]

### Ports
+5V_P (bidir), +7V_S1 (bidir), +7V_S2 (bidir), +12V_P (bidir), +12V_S1 (bidir), +12V_S2 (bidir), -5V_P (bidir)

### Nets
+5V_P: C107.1 C108.2 U4.3(OUT) ; port +5V_P
-5V_P: C109.2 C110.1 U5.3(OUT) ; port -5V_P
GND: C95.2 C100.2 C105.2 C106.2 C107.2 C108.1 C109.1 C110.2 C111.1 CM3.4 CM4.4 NMH1.2(-Vin) NMH1.5(Com) U4.2(GND) U4.4(GND) U5.1(GND)
GND_S1: C97.1 C98.1 C99.2 MEJ3.5(-Vout) R86.2 R87.2 XC4.2(Vss)
GND_S2: C102.1 C103.1 C104.2 MEJ4.5(-Vout) R89.2 R90.2 XC5.2(Vss)
NetC41_1: C99.1 R85.1 XC4.1(Vout) ; port +7V_S1
NetC51_1: C104.1 R88.1 XC5.1(Vout) ; port +7V_S2
NetC56_1: C95.1 C100.1 C106.1 CM3.1 CM4.1 NMH1.1(+Vin) ; port +12V_P
NetC96_1: C96.1 CM3.2 MEJ3.1(+Vin)
NetC96_2: C96.2 CM3.3 MEJ3.2(-Vin)
NetC97_2: C97.2 C98.2 MEJ3.7(+Vout) R86.1 XC4.3(CE) XC4.5(Vin) ; port +12V_S1
NetC101_1: C101.1 CM4.2 MEJ4.1(+Vin)
NetC101_2: C101.2 CM4.3 MEJ4.2(-Vin)
NetC102_2: C102.2 C103.2 MEJ4.7(+Vout) R89.1 XC5.3(CE) XC5.5(Vin) ; port +12V_S2
NetC105_1: C105.1 NMH1.6(+Vout) U4.1(IN)
NetC111_2: C111.2 NMH1.4(-Vout) U5.4(IN)
NetR85_2: R85.2 R87.1 XC4.4(Vofb)
NetR88_2: R88.2 R90.1 XC5.4(Vofb)

### Notes on the sheet
- (in symbol res_smd) 392; 22k; 10k

### Library data of the parts
C95 C96 C99-C101 C104 = Cap Pol3: Polarized Capacitor (Surface Mount); Published: 8-Jun-2000; LatestRevisionDate: 29-May-2009; LatestRevisionNote: IPC-7351 Footprint Added.; PackageReference: C0805; Publisher: Altium Limited; PackageDescription: Chip Capacitor
C97 C98 C102 C103 = Cap Semi: Capacitor (Semiconductor SIM Model); Published: 8-Jun-2000; LatestRevisionDate: 29-May-2009; LatestRevisionNote: IPC-7351 Footprint Added.; PackageReference: C1206; Publisher: Altium Limited; PackageDescription: Chip Capacitor
C105-C107 C109 C111 = Cap Pol1: Polarized Capacitor (Radial); Published: 8-Jun-2000; LatestRevisionDate: 17-Jul-2002; LatestRevisionNote: Re-released for DXP Platform.; PackageReference: RB7.6-15; Publisher: Altium Limited
C108 C110 = Cap: Capacitor; Published: 8-Jun-2000; LatestRevisionDate: 17-Jul-2002; LatestRevisionNote: Re-released for DXP Platform.; PackageReference: RAD-0.3; Publisher: Altium Limited
CM3 CM4 = CMC-08: Common mode choke
MEJ3 MEJ4 = Power supply2
NMH1 = NMH----SC_1
R85-R90 = res_smd: smd_res
U4 = µA7805CKTER: Positive-Voltage Regulator; Note: Pin 2 is electrically connected to TAB/Pin4.; Published: 15-Apr-2002; DatasheetVersion: Jul-1999; PackageVersion: Jan-2001; PackageReference: KTE03; Publisher: Altium Limited; PackageDescription: PowerFLEX; 3 Leads; Body 10.7 (inc. leads) x 9.5 mm (LxW max); Code_JEDEC: MO-169; ComponentLink1Description: Manufacturer Link; ComponentLink1URL: http://www.ti.com/; ComponentLink2Description: Datasheet; ComponentLink2URL: http://www-s.ti.com/sc/ds/ua7805.pdf
U5 = µA79M05CKTPR: Negative-Voltage Regulator; Note: Pin 2 is electrically connected to pin4, and not drawn.; Published: 15-Apr-2002; DatasheetVersion: Apr-2000; PackageVersion: Jan-2001; PackageReference: KTP02; Publisher: Altium Limited; PackageDescription: PowerFLEX (D-PAK/TO-252-AA); 3 Leads (1 Cropped); Body 9.7 (inc. leads) x 6.2 mm (LxW max); Code_JEDEC: TO-252; ComponentLink1Description: Manufacturer Link; ComponentLink1URL: http://www.ti.com/; ComponentLink2Description: Datasheet; ComponentLink2URL: http://www-s.ti.com/sc/ds/ua79m05.pdf
XC4 XC5 = power supply

## Sheet Protection_logic.SchDoc
size A3
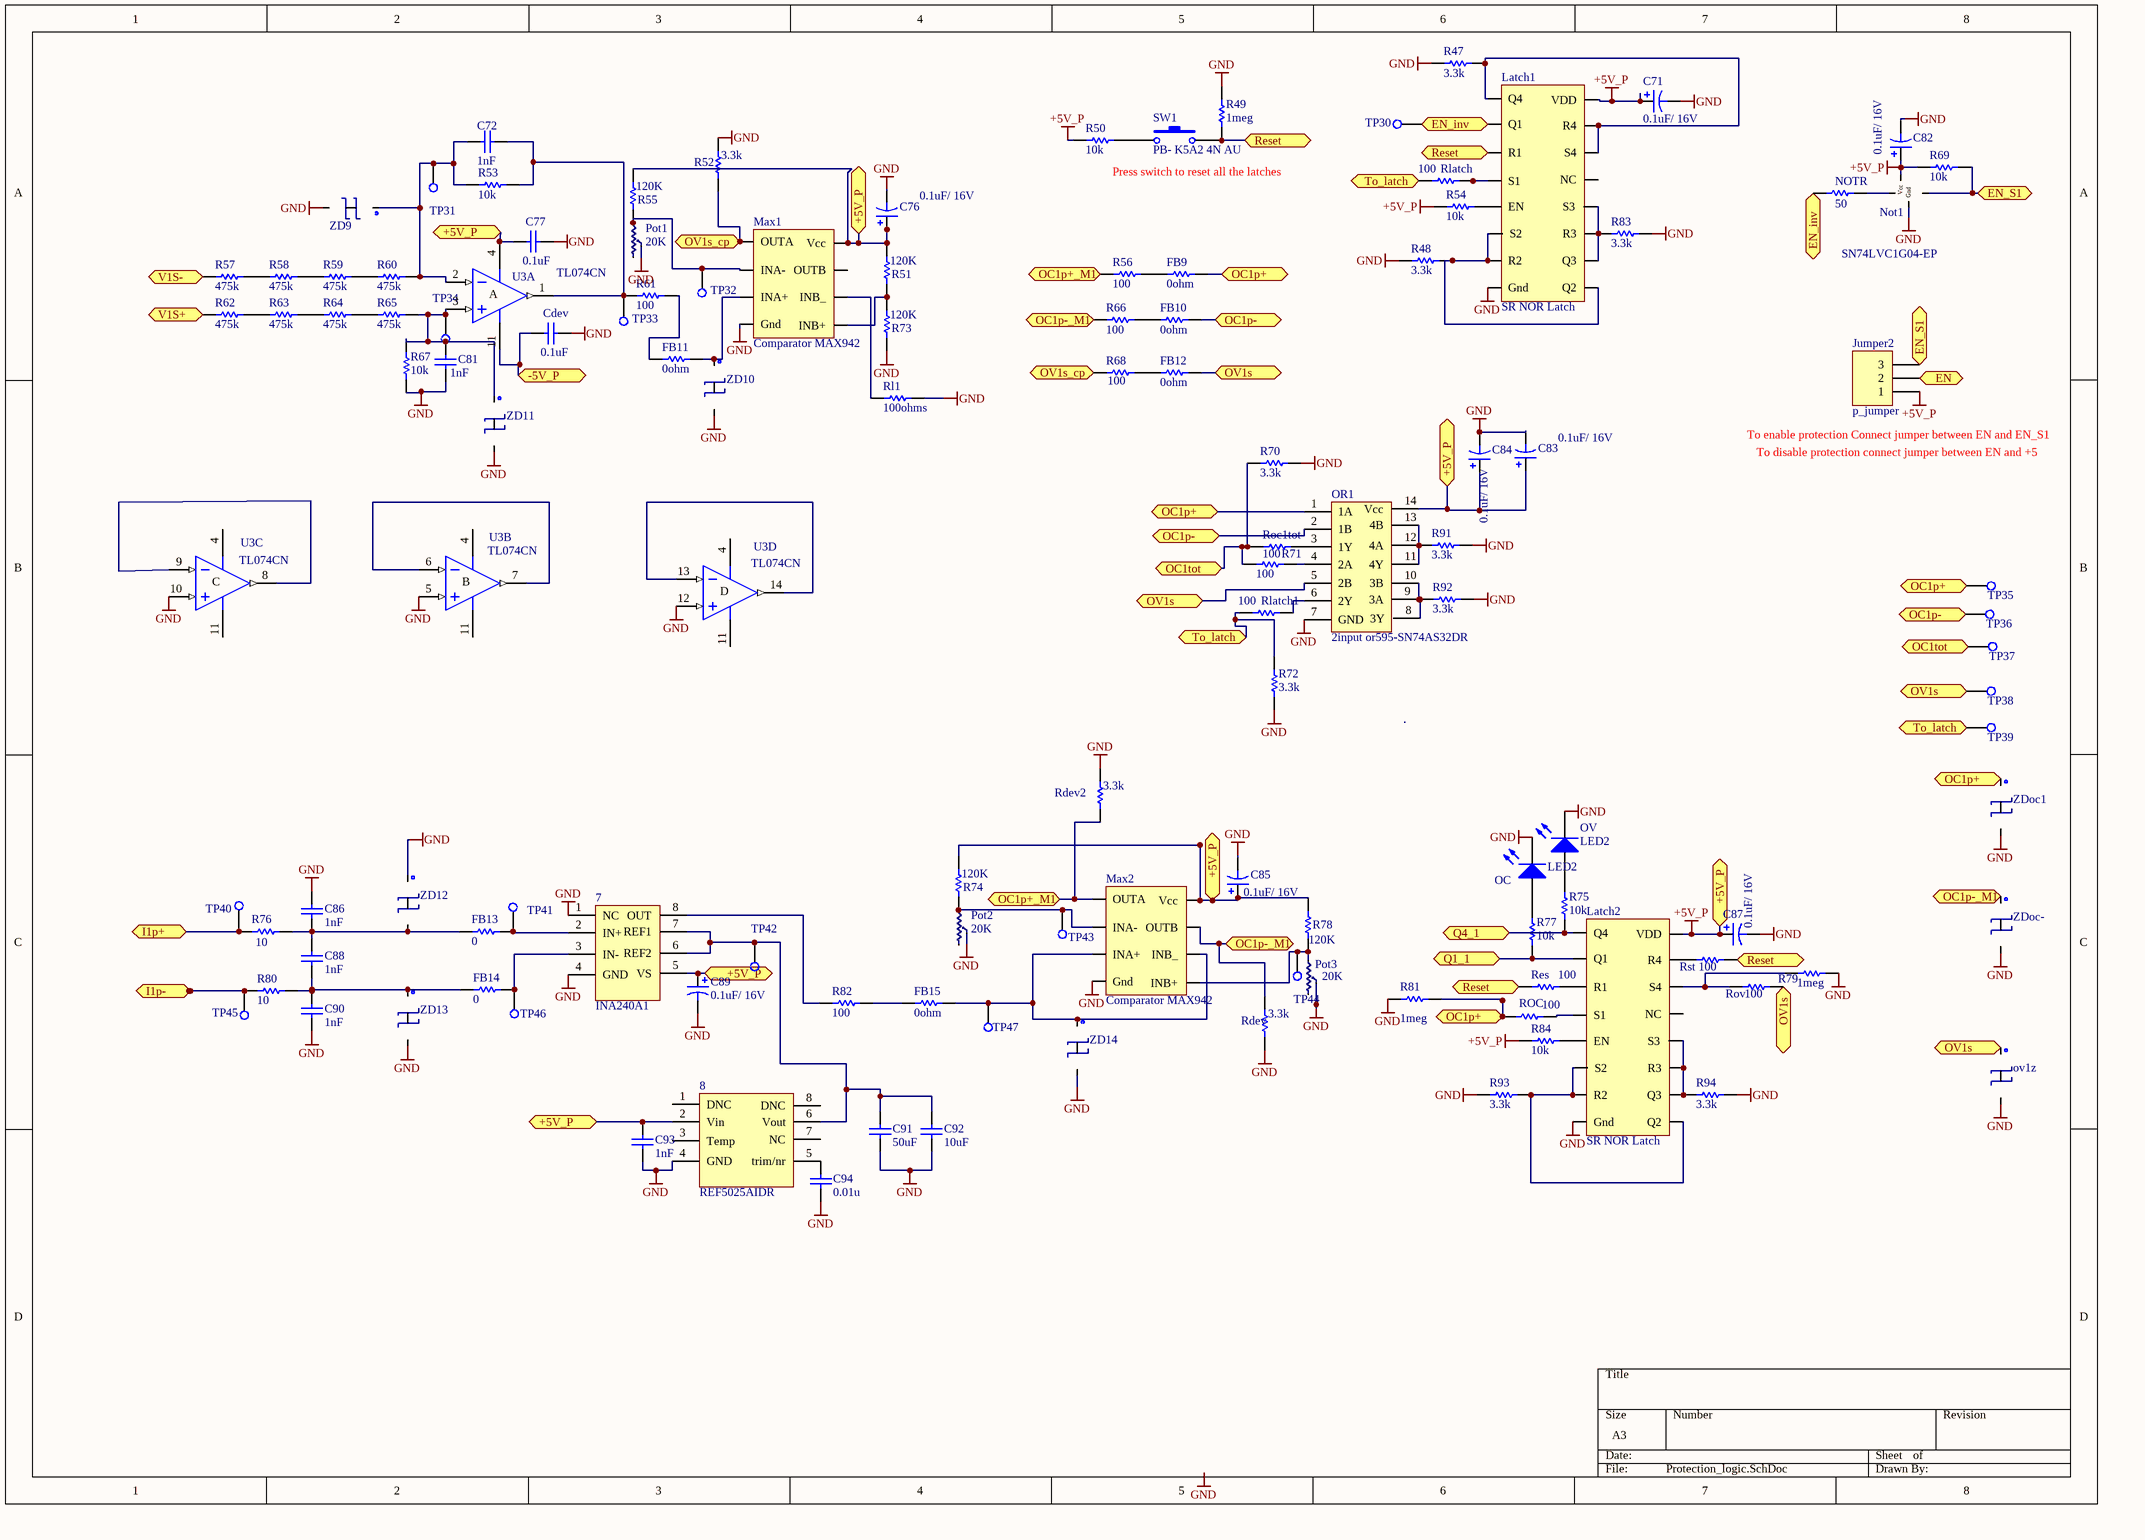
[diagram p4: Protection_logic.SchDoc]

### Parts
7  INA240A1  [INA240]
8  REF5025AIDR  [REF52.5]
C71  value 0.1uF/ 16V  [C0805]  (hidden comment: Cap Pol3)
C72  value 1nF  [C1206]  (hidden comment: 16V)
C76  value 0.1uF/ 16V  [C0805]  (hidden comment: Cap Pol3)
C77  value 0.1uF  [C1206]  (hidden comment: 16V)
C81  value 1nF  [C1206]  (hidden comment: 16V)
C82  value 0.1uF/ 16V  [C0805]  (hidden comment: Cap Pol3)
C83  value 0.1uF/ 16V  [C0805]  (hidden comment: Cap Pol3)
C84  value 0.1uF/ 16V  [C0805]  (hidden comment: Cap Pol3)
C85  value 0.1uF/ 16V  [C0805]  (hidden comment: Cap Pol3)
C86  value 1nF  [C1206]  (hidden comment: 16V)
C87  value 0.1uF/ 16V  [C0805]  (hidden comment: Cap Pol3)
C88  value 1nF  [C1206]  (hidden comment: 16V)
C89  value 0.1uF/ 16V  [C0805]  (hidden comment: Cap Pol3)
C90  value 1nF  [C1206]  (hidden comment: 16V)
C91  value 50uF  [C1206]  (hidden comment: 16V)
C92  value 10uF  [C1206]  (hidden comment: 16V)
C93  value 1nF  [C1206]  (hidden comment: 16V)
C94  value 0.01u  [C1206]  (hidden comment: 16V)
Cdev  value 0.1uF  [C1206]  (hidden comment: 16V)
FB9  res_smd  [res_smd]  (value not drawn)
FB10  res_smd  [res_smd]  (value not drawn)
FB11  res_smd  [res_smd]  (value not drawn)
FB12  res_smd  [res_smd]  (value not drawn)
FB13  res_smd  [res_smd]  (value not drawn)
FB14  res_smd  [res_smd]  (value not drawn)
FB15  res_smd  [res_smd]  (value not drawn)
Jumper2  p_jumper  [Header1*3]
Latch1  SR NOR Latch  [SR latch]
Latch2  SR NOR Latch  [SR latch]
Max1  Comparator MAX942  [SOIC 8_ no EP]
Max2  Comparator MAX942  [SOIC 8_ no EP]
Not1  SN74LVC1G04-EP  [Inverter]
NOTR  res_smd  [res_smd]  (value not drawn)
OC  LED2  [3.2X1.6X1.1]
OR1  2input or595-SN74AS32DR  [2inputor]
OV  LED2  [3.2X1.6X1.1]
ov1z  8.2 v  [Zener Diode]  (value not drawn)
Pot1  20K  [Pot]
Pot2  20K  [Pot]
Pot3  20K  [Pot]
R47  res_smd  [res_smd]  (value not drawn)
R48  res_smd  [res_smd]  (value not drawn)
R49  res_smd  [res_smd]  (value not drawn)
R50  res_smd  [res_smd]  (value not drawn)
R51  res_smd  [res_smd]  (value not drawn)
R52  res_smd  [res_smd]  (value not drawn)
R53  res_smd  [res_smd]  (value not drawn)
R54  res_smd  [res_smd]  (value not drawn)
R55  res_smd  [res_smd]  (value not drawn)
R56  res_smd  [res_smd]  (value not drawn)
R57  res_smd  [res_smd]  (value not drawn)
R58  res_smd  [res_smd]  (value not drawn)
R59  res_smd  [res_smd]  (value not drawn)
R60  res_smd  [res_smd]  (value not drawn)
R61  res_smd  [res_smd]  (value not drawn)
R62  res_smd  [res_smd]  (value not drawn)
R63  res_smd  [res_smd]  (value not drawn)
R64  res_smd  [res_smd]  (value not drawn)
R65  res_smd  [res_smd]  (value not drawn)
R66  res_smd  [res_smd]  (value not drawn)
R67  res_smd  [res_smd]  (value not drawn)
R68  res_smd  [res_smd]  (value not drawn)
R69  res_smd  [res_smd]  (value not drawn)
R70  res_smd  [res_smd]  (value not drawn)
R71  res_smd  [res_smd]  (value not drawn)
R72  res_smd  [res_smd]  (value not drawn)
R73  res_smd  [res_smd]  (value not drawn)
R74  res_smd  [res_smd]  (value not drawn)
R75  res_smd  [res_smd]  (value not drawn)
R76  res_smd  [res_smd]  (value not drawn)
R77  res_smd  [res_smd]  (value not drawn)
R78  res_smd  [res_smd]  (value not drawn)
R79  res_smd  [res_smd]  (value not drawn)
R80  res_smd  [res_smd]  (value not drawn)
R81  res_smd  [res_smd]  (value not drawn)
R82  res_smd  [res_smd]  (value not drawn)
R83  res_smd  [res_smd]  (value not drawn)
R84  res_smd  [res_smd]  (value not drawn)
R91  res_smd  [res_smd]  (value not drawn)
R92  res_smd  [res_smd]  (value not drawn)
R93  res_smd  [res_smd]  (value not drawn)
R94  res_smd  [res_smd]  (value not drawn)
Rdev  res_smd  [res_smd]  (value not drawn)
Rdev2  res_smd  [res_smd]  (value not drawn)
Res  res_smd  [res_smd]  (value not drawn)
Rl1  res_smd  [res_smd]  (value not drawn)
Rlatch  res_smd  [res_smd]  (value not drawn)
Rlatch1  res_smd  [res_smd]  (value not drawn)
ROC  res_smd  [res_smd]  (value not drawn)
Roc1tot  res_smd  [res_smd]  (value not drawn)
Rov  res_smd  [res_smd]  (value not drawn)
Rst  res_smd  [res_smd]  (value not drawn)
SW1  PB- K5A2 4N AU  [Push Button _New]
TP30  Test Point  [Test Point]  (value not drawn)
TP31  Test Point  [Test Point]  (value not drawn)
TP32  Test Point  [Test Point]  (value not drawn)
TP33  Test Point  [Test Point]  (value not drawn)
TP34  Test Point  [Test Point]  (value not drawn)
TP35  Test Point  [Test Point]  (value not drawn)
TP36  Test Point  [Test Point]  (value not drawn)
TP37  Test Point  [Test Point]  (value not drawn)
TP38  Test Point  [Test Point]  (value not drawn)
TP39  Test Point  [Test Point]  (value not drawn)
TP40  Test Point  [Test Point]  (value not drawn)
TP41  Test Point  [Test Point]  (value not drawn)
TP42  Test Point  [Test Point]  (value not drawn)
TP43  Test Point  [Test Point]  (value not drawn)
TP44  Test Point  [Test Point]  (value not drawn)
TP45  Test Point  [Test Point]  (value not drawn)
TP46  Test Point  [Test Point]  (value not drawn)
TP47  Test Point  [Test Point]  (value not drawn)
U3  TL074CN  [DIP14]  (parts A,B,C,D of 4)
ZD9  8.2 v  [Zener Diode]  (value not drawn)
ZD10  8.2 v  [Zener Diode]  (value not drawn)
ZD11  8.2 v  [Zener Diode]  (value not drawn)
ZD12  8.2 v  [Zener Diode]  (value not drawn)
ZD13  8.2 v  [Zener Diode]  (value not drawn)
ZD14  8.2 v  [Zener Diode]  (value not drawn)
ZDoc1  8.2 v  [Zener Diode]  (value not drawn)
ZDoc-  8.2 v  [Zener Diode]  (value not drawn)

### Ports
+5V_P (bidir), -5V_P (bidir), EN, EN_inv, EN_S1, I1p+, I1p-, OC1p+, OC1p+_M1, OC1p-, OC1p-_M1, OC1tot, OV1s, OV1s_cp, Q1_1, Q4_1, Reset, To_latch (bidir), V1S+, V1S-

### Nets
+5V_P: 7.5(VS) 8.2(Vin) C71.1 C76.1 C77.2 C82.1 C83.1 C84.1 C85.1 C87.1 C89.1 C93.2 Jumper2.1 Latch1.16(VDD) Latch2.16(VDD) Max1.8(Vcc) Max2.8(Vcc) Not1.5(Vcc) OR1.14(Vcc) R50.2 R51.2 R54.2 R55.2 R69.2 R74.2 R78.2 R84.2 U3.4(V+) ; port +5V_P
-5V_P: Cdev.2 U3.11(V-) ; port -5V_P
GND: 7.1(NC) 7.4(GND) 8.4(GND) C71.2 C76.2 C77.1 C81.2 C82.2 C83.2 C84.2 C85.2 C86.2 C87.2 C89.2 C90.1 C91.1 C92.1 C93.1 C94.1 Cdev.1 Latch1.8(Gnd) Latch2.8(Gnd) Max1.4(Gnd) Max2.4(Gnd) Not1.3(Gnd) OC.2(K) OR1.7(GND) OV.2(K) ov1z.2 Pot1.2 Pot2.2 Pot3.2 R47.2 R48.2 R49.1 R52.2 R67.2 R70.2 R72.1 R73.1 R79.1 R81.2 R83.2 R91.2 R92.2 R93.2 R94.2 Rdev.1 Rdev2.2 Rl1.1 U3.5(IN+) U3.10(IN+) U3.12(IN+) ZD9.2 ZD10.2 ZD11.2 ZD12.1 ZD13.2 ZD14.2 ZDoc1.2 ZDoc-.2
GND_SS1: R57.2 ; port V1S-
Net7_2: 7.2(IN+) FB13.1 TP41.1(TP?)
Net7_3: 7.3(IN-) FB14.1 TP46.1(TP?)
Net7_6: 7.6(REF2) 7.7(REF1) 8.6(Vout) C91.2 C92.2 TP42.1(TP?)
Net7_8: 7.8(OUT) R82.2
Net8_5: 8.5(trim/nr) C94.2
NetC21_2: R62.2 ; port V1S+
NetC72_1: C72.1 R53.1 R61.2 TP33.1(TP?) U3.1(OUT)
NetC72_2: C72.2 R53.2 R60.1 TP31.1(TP?) U3.2(IN-) ZD9.1
NetC81_1: C81.1 R65.1 R67.1 TP34.1(TP?) U3.3(IN+) ZD11.1
NetC86_1: C86.1 C88.2 FB13.2 R76.1 ZD12.2
NetC88_1: C88.1 C90.2 FB14.2 R80.1 ZD13.1
NetFB9_1: FB9.1 OR1.1(1A) R81.1 ROC.2 TP35.1(TP?) ZDoc1.1 ; port OC1p+
NetFB9_2: FB9.2 R56.1
NetFB10_1: FB10.1 OR1.2(1B) TP36.1(TP?) ; port OC1p-
NetFB10_2: FB10.2 R66.1
NetFB11_1: FB11.1 Max1.3(INA+) ZD10.1
NetFB11_2: FB11.2 R61.1
NetFB12_1: FB12.1 OR1.5(2B) ov1z.1 Rov.1 TP38.1(TP?) ; port OV1s
NetFB12_2: FB12.2 R68.1
NetFB15_1: FB15.1 Max2.3(INA+) Max2.6(INB_) TP47.1(TP?) ZD14.1
NetFB15_2: FB15.2 R82.1
NetGD1_4: Jumper2.2 ; port EN
NetJumper2_3: Jumper2.3 Not1.4(Y) R69.1 ; port EN_S1
NetLatch1_1: Latch1.1(Q4) Latch1.14(S4) Latch1.15(R4) R47.1
NetLatch1_2: Latch1.2(Q1) NOTR.2 TP30.1(TP?) ; port EN_inv
NetLatch1_3: Latch1.3(R1) R49.2 Res.2 Rst.1 SW1.2 ; port Reset
NetLatch1_4: Latch1.4(S1) Rlatch.1
NetLatch1_5: Latch1.5(EN) R54.1
NetLatch1_6: Latch1.6(S2) Latch1.7(R2) Latch1.9(Q2) R48.1
NetLatch1_10: Latch1.10(Q3) Latch1.11(R3) Latch1.12(S3) R83.1
NetLatch2_1: Latch2.1(Q4) R75.1 ; port Q4_1
NetLatch2_2: Latch2.2(Q1) R77.1 ; port Q1_1
NetLatch2_3: Latch2.3(R1) Res.1
NetLatch2_4: Latch2.4(S1) ROC.1
NetLatch2_5: Latch2.5(EN) R84.1
NetLatch2_6: Latch2.6(S2) Latch2.7(R2) Latch2.9(Q2) R93.1
NetLatch2_10: Latch2.10(Q3) Latch2.11(R3) Latch2.12(S3) R94.1
NetLatch2_14: Latch2.14(S4) R79.2 Rov.2
NetLatch2_15: Latch2.15(R4) Rst.2
NetMax1_1: Max1.1(OUTA) R52.1 R68.2 ; port OV1s_cp
NetMax1_2: Max1.2(INA-) Pot1.1 R55.1 TP32.1(TP?)
NetMax1_5: Max1.5(INB+) R51.1 R73.2
NetMax1_6: Max1.6(INB_) Rl1.2
NetMax2_1: Max2.1(OUTA) R56.2 Rdev2.1 ; port OC1p+_M1
NetMax2_2: Max2.2(INA-) Pot2.1 R74.1 TP43.1(TP?)
NetMax2_5: Max2.5(INB+) Pot3.1 R78.1 TP44.1(TP?)
NetMax2_7: Max2.7(OUTB) R66.2 Rdev.2 ZDoc-.1 ; port OC1p-_M1
NetNot1_2: Not1.2(A) NOTR.1
NetOC_1: OC.1(A) R77.2
NetOR1_3: OR1.3(1Y) Roc1tot.1
NetOR1_4: OR1.4(2A) R71.1
NetOR1_6: OR1.6(2Y) Rlatch1.1
NetOR1_8: OR1.8(3Y) OR1.9(3A) OR1.10(3B) R92.1
NetOR1_11: OR1.11(4Y) OR1.12(4A) OR1.13(4B) R91.1
NetOV_1: OV.1(A) R75.2
NetR50_1: R50.1 SW1.1
NetR57_1: R57.1 R58.2
NetR58_1: R58.1 R59.2
NetR59_1: R59.1 R60.2
NetR62_1: R62.1 R63.2
NetR63_1: R63.1 R64.2
NetR64_1: R64.1 R65.2
NetR70_1: R70.1 R71.2 Roc1tot.2 TP37.1(TP?) ; port OC1tot
NetR72_2: R72.2 Rlatch.2 Rlatch1.2 TP39.1(TP?) ; port To_latch
NetR76_2: R76.2 TP40.1(TP?) ; port I1p+
NetR80_2: R80.2 TP45.1(TP?) ; port I1p-
NetU3_6: U3.6(IN-) U3.7(OUT)
NetU3_8: U3.8(OUT) U3.9(IN-)
NetU3_13: U3.13(IN-) U3.14(OUT)

Not connected (* = marked no-connect by the designer): 8 1(DNC) 3(Temp) 7(NC) 8(DNC); Latch1 13(NC); Latch2 13(NC); Max1 7(OUTB); ov1z 3; Pot1 3; Pot2 3; Pot3 3; ZD9 3; ZD10 3; ZD11 3; ZD12 3; ZD13 3; ZD14 3; ZDoc1 3; ZDoc- 3

### Notes on the sheet
- Press switch to reset all the latches
- (near Jumper2) To enable protection Connect jumper between EN and EN_S1
- To disable protection connect jumper between EN and +5
- Labels drawn without touching a wire or pin: GND
- (in symbol res_smd) 100; 475k; 10k; 120K; 1meg; 3.3k; 10; 0; 0ohm; 50; 100ohms
- (in symbol TL074J, part A) A
- (in symbol TL074J, part B) B
- (in symbol TL074J, part C) C
- (in symbol TL074J, part D) D

### Library data of the parts
7 = ina240: GAIN 20
C71 C76 C82-C85 C87 C89 = Cap Pol3: Polarized Capacitor (Surface Mount); Published: 8-Jun-2000; LatestRevisionDate: 29-May-2009; LatestRevisionNote: IPC-7351 Footprint Added.; PackageReference: C0805; Publisher: Altium Limited; PackageDescription: Chip Capacitor
C72 C77 C81 C86 C88 C90-C94 Cdev = Cap Semi: Capacitor (Semiconductor SIM Model); Published: 8-Jun-2000; LatestRevisionDate: 29-May-2009; LatestRevisionNote: IPC-7351 Footprint Added.; PackageReference: C1206; Publisher: Altium Limited; PackageDescription: Chip Capacitor
FB9-FB15 NOTR R47-R84 R91-R94 Rdev Rdev2 Res Rl1 Rlatch Rlatch1 ROC Roc1tot Rov Rst = res_smd: smd_res
Latch1 Latch2 = SR Latch: CD4043BDR
Max1 Max2 = Max942: MAX942ESA+
Not1 = Inverter
OC OV = LED2: Typical RED, GREEN, YELLOW, AMBER GaAs LED; Published: 8-Jun-2000; LatestRevisionDate: 17-Jul-2002; LatestRevisionNote: Re-released for DXP Platform.; PackageVersion: Feb-2002; PackageReference: 3.2X1.6X1.1; Publisher: Altium Limited; PackageDescription: SM LED; 2 Flat Leads
OR1 = 2 input OR
ov1z ZD9-ZD14 ZDoc1 ZDoc- = Zener_diode: DZ23C8V2-7-F
Pot1-Pot3 = TRIM POT: 3296W-1-253LF
SW1 = SW-PB: Switch; Published: 24-Mar-1999; Revision: July-2002: Re-released for DXP Platform.; Publisher: Altium Limited
U3 = TL074J: Low-Noise JFET-Input Operational Amplifier; Published: 16-Jan-2001; LatestRevisionDate: 04-Mar-2005; LatestRevisionNote: Stylized 3D Model Added.; DatasheetVersion: Aug-1996; PackageVersion: Jun-1999; PackageReference: J014; Publisher: Altium Limited; PackageDescription: DIP; 14 Leads; Row Spacing 7.62 mm; Pitch 2.54 mm; ComponentLink1Description: Manufacturer Link; ComponentLink1URL: http://www.ti.com/; ComponentLink2Description: Datasheet; ComponentLink2URL: http://www-s.ti.com/sc/ds/tl074.pdf

## Nets that join several sheets
+5V_P: Gate_Drivers (12 pins), Power_Supply2 (C107.1 C108.2 U4.3), Protection_logic (28 pins)
-5V_P: Power_Supply2 (C109.2 C110.1 U5.3), Protection_logic (Cdev.2 U3.11)
GND: Power_Board (57 pins), Gate_Drivers (12 pins), Power_Supply (11 pins), Power_Supply2 (16 pins), Protection_logic (61 pins)
GND_P1: Power_Board (GaN1.SS GaN2.SS), Gate_Drivers (15 pins), Power_Supply (7 pins)
GND_P2: Power_Board (GaN5.SS GaN6.SS), Gate_Drivers (15 pins), Power_Supply (7 pins)
GND_S1: Power_Board (GaN3.SS GaN4.SS), Gate_Drivers (15 pins), Power_Supply2 (7 pins)
GND_S2: Power_Board (GaN7.SS GaN8.SS), Gate_Drivers (15 pins), Power_Supply2 (7 pins)
GND_SS1: Power_Board (6 pins), Protection_logic (R57.2)
NetC13_1: Power_Board (C13.1 Jumper1.2), Power_Supply (C68.1 Power1.22 Power1.23)
NetC21_2: Power_Board (9 pins), Protection_logic (R62.2)
NetC36_1: Gate_Drivers (C36.1 C37.1 GD1.8), Power_Supply (C60.1 R41.1 XC1.1)
NetC41_1: Gate_Drivers (C41.1 C42.1 GD2.8), Power_Supply2 (C99.1 R85.1 XC4.1)
NetC46_1: Gate_Drivers (C46.1 C47.1 GD3.8), Power_Supply (C65.1 R44.1 XC2.1)
NetC51_1: Gate_Drivers (C51.1 C52.1 GD4.8), Power_Supply2 (C104.1 R88.1 XC5.1)
NetC56_1: Power_Board (P1.11 P1.12 P3.2 P4.2), Power_Supply (7 pins), Power_Supply2 (6 pins)
NetFB1_2: Power_Board (GaN1.G GaN2.G), Gate_Drivers (FB1.2 FB2.2 ZD1.1 ZD2.1)
NetFB3_2: Power_Board (GaN3.G GaN4.G), Gate_Drivers (FB3.2 FB4.2 ZD3.1 ZD4.1)
NetFB5_2: Power_Board (GaN5.G GaN6.G), Gate_Drivers (FB5.2 FB6.2 ZD5.1 ZD6.1)
NetFB7_2: Power_Board (GaN7.G GaN8.G), Gate_Drivers (FB7.2 FB8.2 ZD7.1 ZD8.1)
NetGD1_4: Gate_Drivers (GD1.4 GD2.4 GD3.4 GD4.4), Protection_logic (Jumper2.2)
NetJumper2_3: Power_Board (P1.15 P1.16), Protection_logic (Jumper2.3 Not1.4 R69.1)
NetP1_7: Power_Board (P1.7 P1.8), Gate_Drivers (R21.2)
NetP1_9: Power_Board (P1.9 P1.10), Gate_Drivers (R31.2)
NetP1_13: Power_Board (P1.13 P1.14), Gate_Drivers (R26.2)
NetP1_19: Power_Board (P1.19 P1.20), Gate_Drivers (R36.2)
NetR76_2: Power_Board (Rsense1.3), Protection_logic (R76.2 TP40.1)
NetR80_2: Power_Board (Rsense1.4), Protection_logic (R80.2 TP45.1)